# EAGLE design working (EAGLE 9.1.1)
COMPANY: ADAFRUIT INDUSTRIES; DRAWN: KTOWN; REV: A
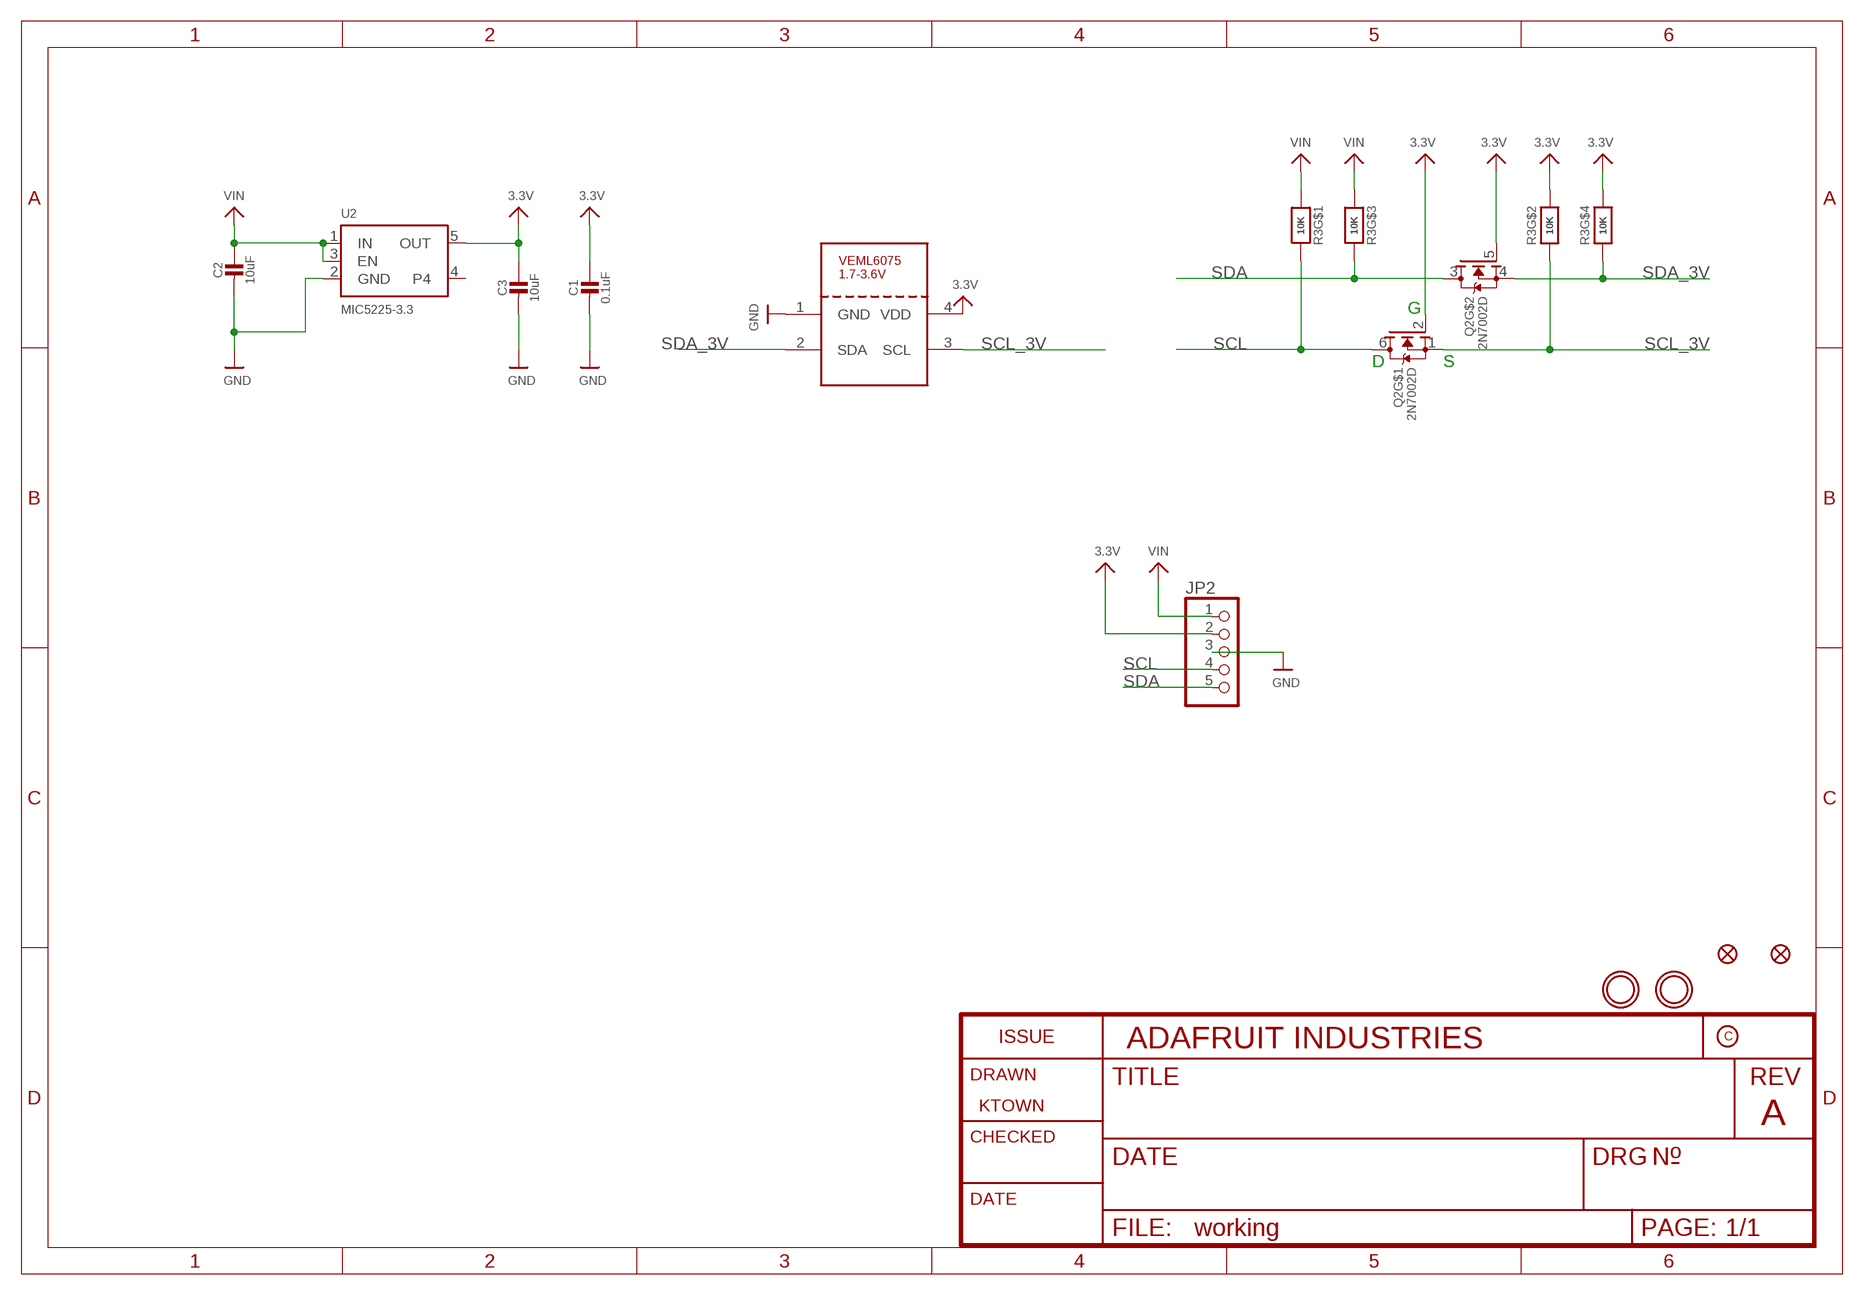
[diagram p0: schematic, sheet 1]

## Parts
C1  0.1uF  CAP_CERAMIC0603_NO  [0603-NO]
C2  10uF  CAP_CERAMIC0805-NOOUTLINE  [0805-NO]
C3  10uF  CAP_CERAMIC0805-NOOUTLINE  [0805-NO]
FID1  FIDUCIAL_1MM  [FIDUCIAL_1MM]
FID2  FIDUCIAL_1MM  [FIDUCIAL_1MM]
JP2  HEADER-1X5ROUND  [1X05_ROUND]
Q2  2N7002D  MOSFET-N_DUAL  [SOT363]
R3  10K  RESISTOR_4PACK  [RESPACK_4X0603]
U2  MIC5225-3.3  VREG_SOT23-5  [SOT23-5]
U$3  MOUNTINGHOLE2.5  [MOUNTINGHOLE_2.5_PLATED]
U$4  MOUNTINGHOLE2.5  [MOUNTINGHOLE_2.5_PLATED]
U$12  VEML6075  [VEML6075]

## Nets
3.3V: C1.1 C3.1 JP2.2 Q2.2(G) Q2.5(G) R3.2 R3.4 U2.5(OUT) U$12.4(VDD)
GND: C1.2 C2.2 C3.2 JP2.3 U2.2(GND) U$12.1(GND)
SCL: JP2.4 Q2.6(D) R3.8
SCL_3V: Q2.1(S) R3.7 U$12.3(SCL)
SDA: JP2.5 Q2.3(D) R3.6
SDA_3V: Q2.4(S) R3.5 U$12.2(SDA)
VIN: C2.1 JP2.1 R3.1 R3.3 U2.1(IN) U2.3(EN)
Unconnected: U2.4

## Notes on the sheet
- G
- D | S

## Library data of the parts
C1-C3 = microbuilder:CAP_CERAMIC: Ceramic Capacitors For new designs, use the packages preceded by an '_' character since they are more reliable: The following footprints should be used on most boards: _0402 - Standard footprint for regular board layouts _0603 - Standard footprint for regular board layouts _0805 - Standard footprint for regular board layouts _1206 - Standard footprint for regular board layouts For extremely tight-pitch boards where space is at a premium, the following 'micro-pitch' footprints can be used (smaller pads, no silkscreen outline, etc.): _0402MP - Micro-pitch footprint for very dense/compact boards _0603MP - Micro-pitch footprint for very dense/compact boards _0805MP - Micro-pitch footprint for very dense/compact boards _1206MP - Micro-pitch footprint for very dense/compact boards
FID1 FID2 = microbuilder:FIDUCIAL: Fiducial Alignment Points Various fiducial points for machine vision alignment.; BOM: EXCLUDE
JP2 = microbuilder:HEADER-1X5: PIN HEADER
Q2 = microbuilder:MOSFET-N_DUAL: Dual N-Channel MOSFET SOT363 (2.0x1.25mm) 2N7002PS - 60V, 320mA [Digikey: 568-5984-1-ND]
R3 = microbuilder:RESISTOR_4PACK: Resistor Packs (4 resistors) 4 x 0603 10K 1/16W - Digikey: YC164J-10KCT-ND
U2 = microbuilder:VREG_SOT23-5: SOT23-5 Fixed Voltage Regulators Part Current Out V Out V In V Dropout θJA (°C/W) TJ (°C) Digikey Part No. ADP121 150mA 3.3V 3.4-5.5V 0.09V @ 150mA -- -- ADP121-AUJZ33R7CT-ND ADP121 150mA 3.0V 3.1-5.5V 0.09V @ 150mA -- -- ADP121-AUJZ30R7CT-ND ADP122 300mA 3.3V 3.4-5.5V 0.085V @ 300mA -- -- ADP122AUJZ-3.3-R7CT-ND ADP1712 300mA 3.3V 3.5-5.5V 0.17V @ 300mA -- -- ADP1712AUJZ-3.3-R7TR-ND AP7311 (Low Cost) 150mA 3.3V 3.5-6V 0.15V @ 150mA -- -- AP7311-33WG-7DICT-ND LD39015M18R 150mA 1.8V 1.9V-5.5V 0.08V @ 100mA -- -- 497-6977-1-ND LP2985A-33DBVR 150mA 3.3V 3.3-16V 0.28V @ 150mA 206 150 296-18479-1-ND MCP1824T-3302E/OT 300mA 3.3V 3.5V-6V 0.2V @ 300mA -- -- MCP1824T-3302E/OTCT-ND MIC5205-2.5YM5 TR 150mA 2.5V 2.7-16V 0.165V @ 150mA -- -- 576-1257-2-ND MIC5205-3.0YM5 TR 150mA 3.0V 3.2V-16V 0.165V @ 150mA -- -- 576-1258-2-ND MIC5205-3.3YM5 TR 150mA 3.3V 3.5V-16V 0.165V @ 150mA -- -- 576-1259-2-ND TPS780330220 150mA 3.3V+2.2V 3.6-5.5V 250mV Max -- -- 296-23332-1-ND TDA3663/N1,135 100mA 3.3V 3.5-45V 0.18V @ 50mA -- -- 568-5343-1-ND Max operating temp can be calculated using θJA, TJ (max junction temperature), and power in watts. Set the "Maximum Ambient Temperature" until it reaches TJ ("Max Junction Temperature"), which is the absolute limit for safe use of the regulator: Heat Sink Temperature Calculator <http://www.daycounter.com/Calculators/Heat-Sink-Temperature-Calculator.phtml> For example, With 12V source into a 3.3V LP2985 and a 30mA load, we are dissipating (12V-3.3V) * 0.03A = 0.261W. With a θJA of 206 °C/W, a TJ of 150°C, and 261mW we can safely use the chip without a heat sink up to 75°C (=147.1°C Junction Temperature).
U$3 U$4 = microbuilder:MOUNTINGHOLE: Mounting Hole For #2 screws (0.086"/2.18mm width, 0.094"/2.4mm hole) use 2.5mm; BOM: EXCLUDE
U$12 = microbuilder:VEML6075: UVA and UVB Light Sensor with I2C Interface

## Board
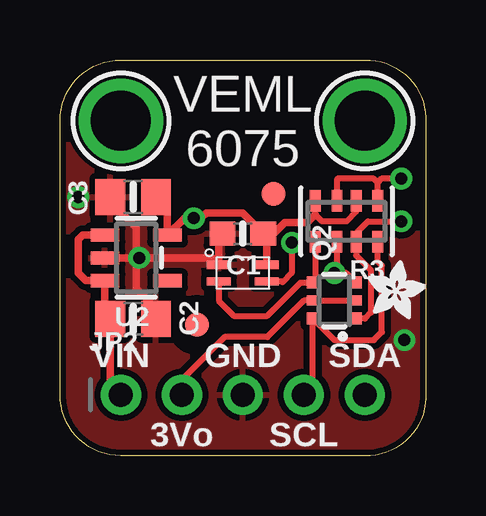
[diagram p1: board, top side]
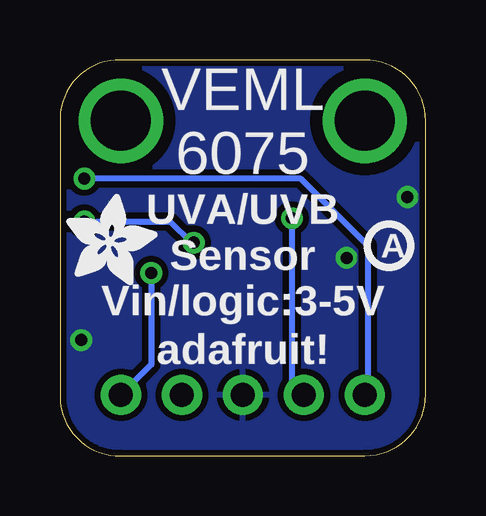
[diagram p2: board, bottom side, seen from below]

Size 15.24 x 16.51 mm. Coordinates in mm from the lower left corner, seen from the top.
Outline: 15.24,14.1 15.24,2.41 arc-90 12.7,0 2.54,0 arc-90 0,2.54 0,13.97 arc-90 2.54,16.51 12.7,16.51 arc-90 15.24,14.1
Copper layers (1*16): Top 0.035mm / dielectric 1.5mm / Bottom 0.035mm
Design rules "adafruit *": minimum track width 8mil, minimum drill 15.5mil, track to track 8mil, track to pad 8mil, pad to pad 8mil, via to via 8mil, smd to smd 8mil, copper to edge 10mil, drill to drill 8mil, minimum pad ring 10mil, minimum via ring 8mil, stop-mask expansion 2mil, vias tented up to drill 20mil, thermal gap 10mil

### Footprints (pad centres in the part's own frame; a part is rotated, then mirrored left to right if it is on the bottom)
0603-NO = smd 1.075 x 1: 1 -0.85,0; 2 0.85,0
0805-NO = smd 1.24 x 1.5: 1 -0.95,0; 2 0.95,0
FIDUCIAL_1MM = smd 1 x 1: 1 0,0
1X05_ROUND = drill 1 pad 1.676: 1 -5.08,0; 2 -2.54,0; 3 0,0; 4 2.54,0; 5 5.08,0
SOT363 = smd 0.5 x 0.5: 1 -0.75,-0.9; 3 0.75,-0.9; 4 0.75,0.9; 6 -0.75,0.9 | smd 0.4 x 0.5: 2 0,-0.9; 5 0,0.9
RESPACK_4X0603 = smd 0.45 x 0.9: 1 -1.3,-0.85; 2 -0.4,-0.85; 3 0.4,-0.85; 4 1.3,-0.85; 5 1.3,0.85; 6 0.4,0.85; 7 -0.4,0.85; 8 -1.3,0.85
SOT23-5 = smd 0.55 x 1.2: 1 -0.95,-1.3; 2 0,-1.3; 3 0.95,-1.3; 4 0.95,1.3; 5 -0.95,1.3
MOUNTINGHOLE_2.5_PLATED = drill 2.5 pad 3.2: P$1 0,0
VEML6075 = smd 1 x 0.35: 1 -1,0.35; 2 -1,-0.35; 3 1,-0.35; 4 1,0.35

### Placement (x,y rotation side)
C1  7.62,9.27 180 top
C2  3.05,5.71 0 top
C3  3.05,10.79 180 top
FID1  8.89,10.92 0 top
FID2  5.71,5.46 0 top
JP2  7.62,2.54 0 top
Q2  11.43,6.48 90 top
R3  11.94,9.78 180 top
U2  3.17,8.26 270 top
U$1  [ADAFRUIT_3.5MM]  14.99,7.11 0 bottom
U$3  2.54,13.97 0 top
U$4  12.7,13.97 0 top
U$8  [ADAFRUIT_2.5MM]  12.83,5.71 0 top
U$12  7.62,7.62 0 top
U$27  [PCBFEAT-REV-040]  1.52,8.76 0 bottom

### Tracks (layer width: path | path; a pad name or v marks a point on that pad's centre or on a via)
3.3V  (via drill 0.5)
  Top 0.254: R3.2 12.34,10.18 11.94,9.78 10.92,9.78 10.64,10.06 R3.4 | Q2.2 Q2.5 10.16,6.48 8.64,4.95 6.86,4.95 5.08,3.17 JP2.2 | v5.59,9.92 v5.58,9.91
  Top 0.305: C3.1 4.47,10.32 U2.5 5.19,9.92 v5.59,9.92 | U$12.4 8.62,9.12 C1.1 | v5.58,9.91 5.87,9.91 6.08,10.13 7.61,10.13 C1.1 | C1.1 8.9,9.27 9.37,9.73 10.31,9.73 10.64,10.06
  Bottom 0.254: v5.58,9.91 5.58,3.04 JP2.2
GND  (via drill 0.5)
  Top 0.305: C3.2 2.1,10.6 3.17,9.53 3.17,8.76 3.17,8.26 | C2.2 4,6.16 3.17,6.99 3.17,8.26 | C1.2 6.62,9.12 U$12.1 6.33,8.26 3.17,8.26 | U2.2 3.17,8.26
  other vias: 0.76,10.79 3.3,8.26 14.35,4.83
  pour Top (isolate 0.254): 0,0 0,16.51 15.24,16.51 15.24,0
  pour Bottom (isolate 0.254): 0,0 0,16.51 15.24,16.51 15.24,0
SCL
  Top 0.254: R3.8 13.24,8.11 13.41,7.94 13.41,5.16 13.08,4.83 11.43,4.83 Q2.6 10.53,2.91 JP2.4
SCL_3V  (via drill 0.5)  (1 unrouted)
  Top 0.254: Q2.1 12.71,5.73 12.95,5.97 12.95,7.75 12.34,8.36 R3.7 12.34,9.29 12.83,9.78 v14.22,9.78 | v9.66,8.89 9.65,8.88 9.65,7.62 9.27,7.24 9.24,7.27 U$12.3
  Bottom 0.254: v14.22,9.78 10.67,9.78 9.78,8.89 v9.66,8.89
SDA  (via drill 0.5)
  Top 0.254: R3.6 11.54,8.02 11.56,8 11.56,7.74 v11.44,7.62 11.94,7.62 Q2.3
  Bottom 0.254: v11.44,7.62 11.44,3.8 JP2.5
SDA_3V
  Top 0.254: R3.5 10.64,7.33 Q2.4 10.02,7.23 8.64,5.84 7.24,5.84 6.62,6.46 U$12.2
VIN  (via drill 0.5)  (1 unrouted)
  Top 0.254: 13.08,11.56 11.56,11.56 11.56,10.65 R3.3 | R3.1 13.24,11.4 | v14.22,11.56 13.39,11.56 13.24,11.4 | 13.24,11.4 | 13.24,11.4 13.08,11.56 | 13.08,11.56 | 13.24,11.4
  Top 0.305: JP2.1 2.1,2.98 C2.1 1.88,5.94 U2.3 1.08,7.3 0.76,7.62 0.76,9.02 0.95,9.21 | 0.95,9.21 | 0.95,9.21 U2.1
  Bottom 0.254: 2.41,2.67 JP2.1 2.41,2.67 | v14.22,11.56 5.21,11.56 2.41,8.76 2.41,2.67

### Text on the board
tPlace: VEML / 6075 | VIN | GND | SDA | 3Vo | SCL
bPlace: VEML / 6075 | UVA/UVB / Sensor / Vin/logic:3-5V | adafruit!